# Altium schematic sheet 14.RK3568_USBPCIeSATA PHY.SchDoc
size 420 x 297 mm
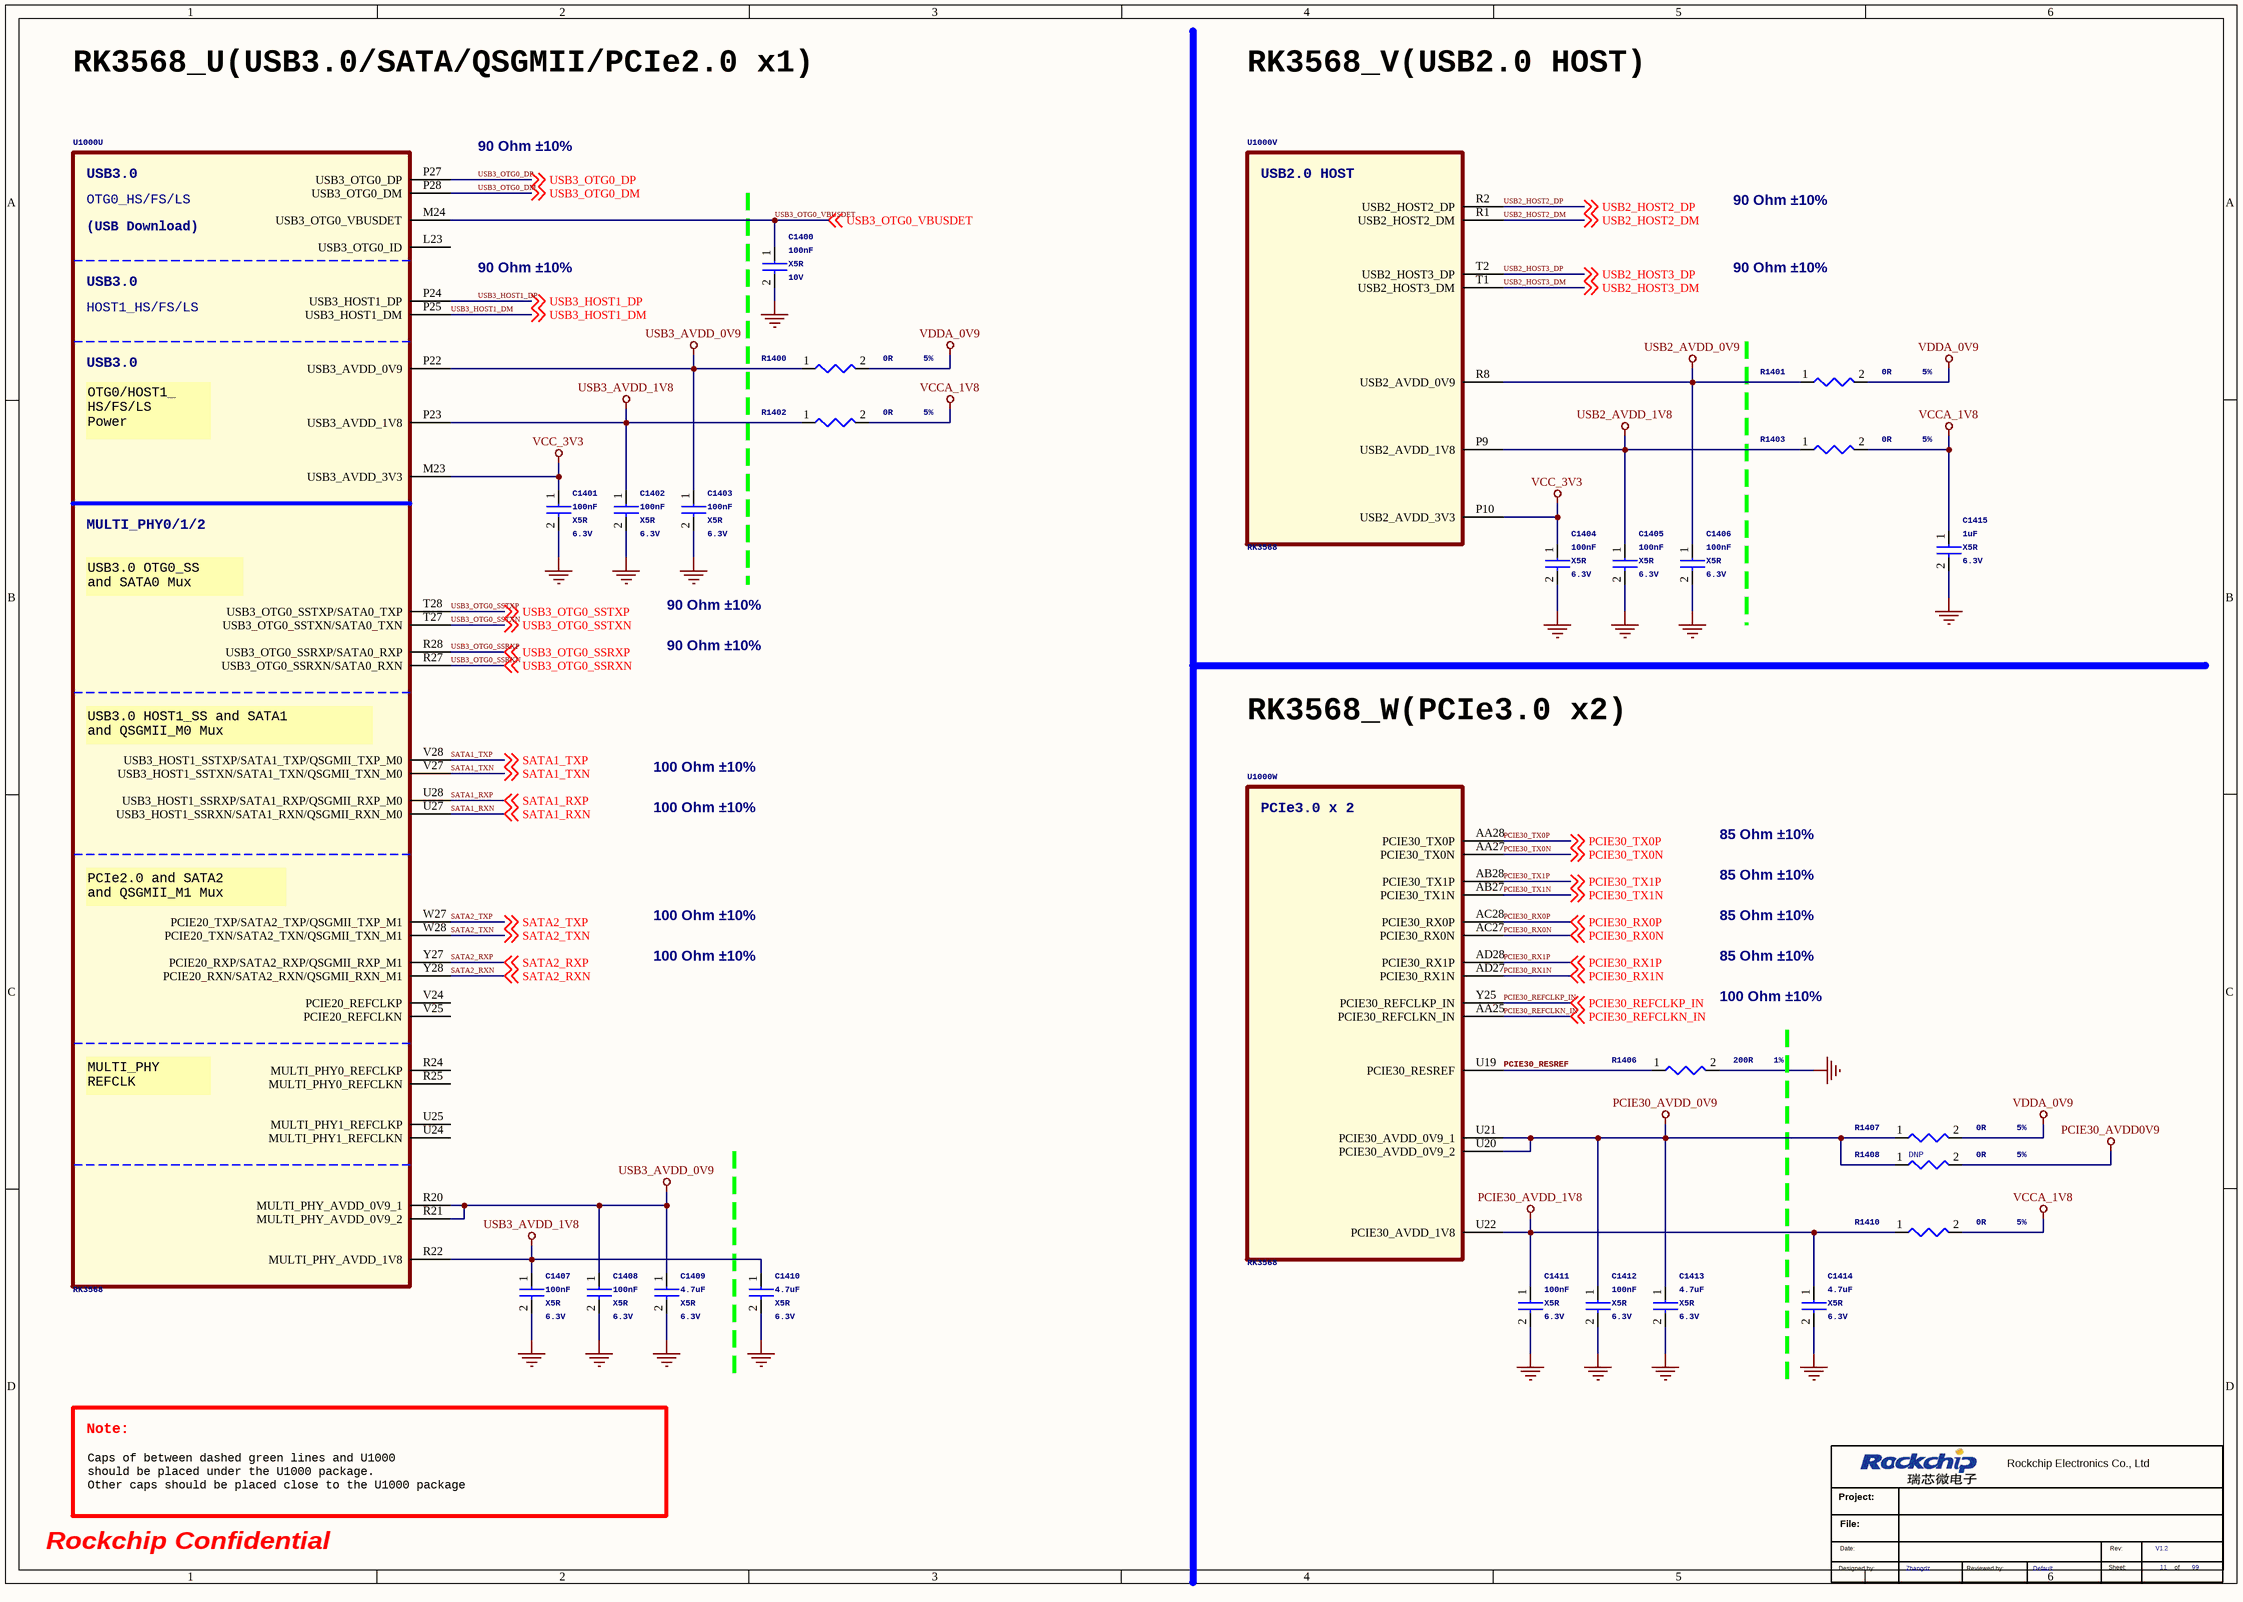
[diagram p0: 14.RK3568_USBPCIeSATA PHY.SchDoc]

## Parts
*  Schematic Page Count: 99  Schematic Page Number: 11  Designer: Zhangdz  Revision: V1.2  Check: Default  (hidden comment: Rockchip_new)  (graphical)
C1400  100nF  Voltage: 10V  Dielectric: X5R  [C0402]
C1401  100nF  Voltage: 6.3V  Dielectric: X5R  [C0201]
C1402  100nF  Voltage: 6.3V  Dielectric: X5R  [C0201]
C1403  100nF  Voltage: 6.3V  Dielectric: X5R  [C0201]
C1404  100nF  Voltage: 6.3V  Dielectric: X5R  [C0201]
C1405  100nF  Voltage: 6.3V  Dielectric: X5R  [C0201]
C1406  100nF  Voltage: 6.3V  Dielectric: X5R  [C0201]
C1407  100nF  Voltage: 6.3V  Dielectric: X5R  [C0201]
C1408  100nF  Voltage: 6.3V  Dielectric: X5R  [C0201]
C1409  4.7uF  Voltage: 6.3V  Dielectric: X5R  [C0402]
C1410  4.7uF  Voltage: 6.3V  Dielectric: X5R  [C0402]
C1411  100nF  Voltage: 6.3V  Dielectric: X5R  [C0201]
C1412  100nF  Voltage: 6.3V  Dielectric: X5R  [C0201]
C1413  4.7uF  Voltage: 6.3V  Dielectric: X5R  [C0402]
C1414  4.7uF  Voltage: 6.3V  Dielectric: X5R  [C0402]
C1415  1uF  Voltage: 6.3V  Dielectric: X5R  [C0402]
R1400  0R  Tolerance: 5%  [R0402]
R1401  0R  Tolerance: 5%  [R0402]
R1402  0R  Tolerance: 5%  [R0402]
R1403  0R  Tolerance: 5%  [R0402]
R1406  200R  Tolerance: 1%  [R0201]
R1407  0R  Tolerance: 5%  [R0402]
R1408  0R  Tolerance: 5%  Option: DNP  [R0402]
R1410  0R  Tolerance: 5%  [R0402]
U1000  RK3568  [BGA636_19R00X19R00X1R20]  (parts U,V,W of 23)

## Nets
GND: C1400.2 C1401.2 C1402.2 C1403.2 C1404.2 C1405.2 C1406.2 C1407.2 C1408.2 C1409.2 C1410.2 C1411.2 C1412.2 C1413.2 C1414.2 C1415.2 R1406.2
PCIE30_AVDD0V9: R1408.2
PCIE30_AVDD_0V9: C1412.1 C1413.1 R1407.1 R1408.1 U1000.U20(PCIE30_AVDD_0V9_2) U1000.U21(PCIE30_AVDD_0V9_1)
PCIE30_AVDD_1V8: C1411.1 C1414.1 R1410.1 U1000.U22(PCIE30_AVDD_1V8)
USB2_AVDD_0V9: C1406.1 R1401.1 U1000.R8(USB2_AVDD_0V9)
USB2_AVDD_1V8: C1405.1 R1403.1 U1000.P9(USB2_AVDD_1V8)
USB3_AVDD_0V9: C1403.1 C1408.1 C1409.1 R1400.1 U1000.P22(USB3_AVDD_0V9) U1000.R20(MULTI_PHY_AVDD_0V9_1) U1000.R21(MULTI_PHY_AVDD_0V9_2)
USB3_AVDD_1V8: C1402.1 C1407.1 C1410.1 R1402.1 U1000.P23(USB3_AVDD_1V8) U1000.R22(MULTI_PHY_AVDD_1V8)
VCC_3V3: C1401.1 C1404.1 U1000.M23(USB3_AVDD_3V3) U1000.P10(USB2_AVDD_3V3)
VCCA_1V8: C1415.1 R1402.2 R1403.2 R1410.2
VDDA_0V9: R1400.2 R1401.2 R1407.2
PCIE30_REFCLKN_IN: U1000.AA25(PCIE30_REFCLKN_IN) ; off-sheet PCIE30_REFCLKN_IN
PCIE30_REFCLKP_IN: U1000.Y25(PCIE30_REFCLKP_IN) ; off-sheet PCIE30_REFCLKP_IN
PCIE30_RESREF: R1406.1 U1000.U19(PCIE30_RESREF)
PCIE30_RX0N: U1000.AC27(PCIE30_RX0N) ; off-sheet PCIE30_RX0N
PCIE30_RX0P: U1000.AC28(PCIE30_RX0P) ; off-sheet PCIE30_RX0P
PCIE30_RX1N: U1000.AD27(PCIE30_RX1N) ; off-sheet PCIE30_RX1N
PCIE30_RX1P: U1000.AD28(PCIE30_RX1P) ; off-sheet PCIE30_RX1P
PCIE30_TX0N: U1000.AA27(PCIE30_TX0N) ; off-sheet PCIE30_TX0N
PCIE30_TX0P: U1000.AA28(PCIE30_TX0P) ; off-sheet PCIE30_TX0P
PCIE30_TX1N: U1000.AB27(PCIE30_TX1N) ; off-sheet PCIE30_TX1N
PCIE30_TX1P: U1000.AB28(PCIE30_TX1P) ; off-sheet PCIE30_TX1P
SATA1_RXN: U1000.U27(USB3_HOST1_SSRXN/SATA1_RXN/QSGMII_RXN_M0) ; off-sheet SATA1_RXN
SATA1_RXP: U1000.U28(USB3_HOST1_SSRXP/SATA1_RXP/QSGMII_RXP_M0) ; off-sheet SATA1_RXP
SATA1_TXN: U1000.V27(USB3_HOST1_SSTXN/SATA1_TXN/QSGMII_TXN_M0) ; off-sheet SATA1_TXN
SATA1_TXP: U1000.V28(USB3_HOST1_SSTXP/SATA1_TXP/QSGMII_TXP_M0) ; off-sheet SATA1_TXP
SATA2_RXN: U1000.Y28(PCIE20_RXN/SATA2_RXN/QSGMII_RXN_M1) ; off-sheet SATA2_RXN
SATA2_RXP: U1000.Y27(PCIE20_RXP/SATA2_RXP/QSGMII_RXP_M1) ; off-sheet SATA2_RXP
SATA2_TXN: U1000.W28(PCIE20_TXN/SATA2_TXN/QSGMII_TXN_M1) ; off-sheet SATA2_TXN
SATA2_TXP: U1000.W27(PCIE20_TXP/SATA2_TXP/QSGMII_TXP_M1) ; off-sheet SATA2_TXP
USB2_HOST2_DM: U1000.R1(USB2_HOST2_DM) ; off-sheet USB2_HOST2_DM
USB2_HOST2_DP: U1000.R2(USB2_HOST2_DP) ; off-sheet USB2_HOST2_DP
USB2_HOST3_DM: U1000.T1(USB2_HOST3_DM) ; off-sheet USB2_HOST3_DM
USB2_HOST3_DP: U1000.T2(USB2_HOST3_DP) ; off-sheet USB2_HOST3_DP
USB3_HOST1_DM: U1000.P25(USB3_HOST1_DM) ; off-sheet USB3_HOST1_DM
USB3_HOST1_DP: U1000.P24(USB3_HOST1_DP) ; off-sheet USB3_HOST1_DP
USB3_OTG0_DM: U1000.P28(USB3_OTG0_DM) ; off-sheet USB3_OTG0_DM
USB3_OTG0_DP: U1000.P27(USB3_OTG0_DP) ; off-sheet USB3_OTG0_DP
USB3_OTG0_SSRXN: U1000.R27(USB3_OTG0_SSRXN/SATA0_RXN) ; off-sheet USB3_OTG0_SSRXN
USB3_OTG0_SSRXP: U1000.R28(USB3_OTG0_SSRXP/SATA0_RXP) ; off-sheet USB3_OTG0_SSRXP
USB3_OTG0_SSTXN: U1000.T27(USB3_OTG0_SSTXN/SATA0_TXN) ; off-sheet USB3_OTG0_SSTXN
USB3_OTG0_SSTXP: U1000.T28(USB3_OTG0_SSTXP/SATA0_TXP) ; off-sheet USB3_OTG0_SSTXP
USB3_OTG0_VBUSDET: C1400.1 U1000.M24(USB3_OTG0_VBUSDET) ; off-sheet USB3_OTG0_VBUSDET

Not connected (* = marked no-connect by the designer): U1000 L23(USB3_OTG0_ID) R24(MULTI_PHY0_REFCLKP) R25(MULTI_PHY0_REFCLKN) U24(MULTI_PHY1_REFCLKN) U25(MULTI_PHY1_REFCLKP) V24(PCIE20_REFCLKP) V25(PCIE20_REFCLKN)

## Notes on the sheet
- RK3568_U(USB3.0/SATA/QSGMII/PCIe2.0 x1)
- RK3568_V(USB2.0 HOST)
- 90 Ohm ±10%
- RK3568_W(PCIe3.0 x2)
- 100 Ohm ±10%
- 85 Ohm ±10%
- Note:
- Caps of between dashed green lines and U1000
  should be placed under the U1000 package.
  Other caps should be placed close to the U1000 package
- Rockchip Confidential
- (in symbol Rockchip_new) Rockchip Electronics Co., Ltd; Project:; File:; Date:; Rev:; Sheet:; of; Designed by:; Reviewed by:
- (in symbol SOC_RK3568, part U) USB3.0; OTG0_HS/FS/LS; (USB Download); HOST1_HS/FS/LS; OTG0/HOST1_ / HS/FS/LS / Power; MULTI_PHY0/1/2; USB3.0 OTG0_SS / and SATA0 Mux; USB3.0 HOST1_SS and SATA1 / and QSGMII_M0 Mux; PCIe2.0 and SATA2 / and QSGMII_M1 Mux; MULTI_PHY / REFCLK
- (in symbol SOC_RK3568, part V) USB2.0 HOST
- (in symbol SOC_RK3568, part W) PCIe3.0 x 2

## Library data of the parts
* = Rockchip_new: Page Count: 37; Revcode: V1.2; Page Number: 11
C1400 = CAP NP: cap,100.00nF,+/-10%,10V,X5R,C0402; Manufacturer PN: C1005X5R1A104K050BA; Manufacturer: TDK; Tolerance: 10%; Priority: A; Created by: JJJ; Part Type: C0402; RK PN: C1005X5R1A104K050BA
C1401-C1408 C1412 = CAP NP: cap,100.00nF,+/-10%,6.3V,X5R,C0201; Manufacturer PN: C0603X5R0J104K030BC; Manufacturer: TDK; Tolerance: 10%; Priority: A; Created by: JJJ; Part Type: C0201; RK PN: C0603X5R0J104K030BC
C1409 C1410 C1413 C1414 = CAP NP: cap,4.70uF,+/-10%,6.3V,X5R,C0402; Manufacturer PN: C1005X5R0J475K050BC; Manufacturer: TDK; Tolerance: 10%; Priority: A; Created by: JJJ; Part Type: C0402; RK PN: C1005X5R0J475K050BC
C1411 = CAP NP: cap,100.00nF,+/-10%,6.3V,X5R,C0201; Manufacturer: TDK; RK PN: C0603X5R0J104K030BC; Priority: A; Tolerance: 10%; Part Type: C0201; Manufacturer PN: C0603X5R0J104K030BC; Created by: JJJ
C1415 = CAP NP: cap,1.00uF,+/-10%,6.3V,X5R,C0402; Manufacturer: TDK; RK PN: C1005X5R0J105K050BB; Priority: A; Tolerance: 10%; Part Type: C0402; Manufacturer PN: C1005X5R0J105K050BB; Created by: JJJ
R1400 R1402 R1403 R1407 = RESISTOR: 通用厚膜电阻,0R,+/-5%,R0402,1/16W.; Manufacturer: YAGEO; RK PN: RC0402JR-070RL; Priority: A; Wattage: 1/16W; Part Type: 通用厚膜电阻; Manufacturer PN: RC0402JR-070RL; Created by: YTL
R1401 R1408 R1410 = RESISTOR: 通用厚膜电阻,0R,+/-5%,R0402,1/16W.; Manufacturer PN: RC0402JR-070RL; Manufacturer: YAGEO; Wattage: 1/16W; Priority: A; Created by: YTL; Part Type: 通用厚膜电阻; RK PN: RC0402JR-070RL
R1406 = RESISTOR: 通用厚膜电阻,200R,+/-1%,R0201,1/20W.; Manufacturer PN: RC0201FR-07200RL; Manufacturer: YAGEO; Wattage: 1/20W; Priority: A; Created by: YTL; Part Type: 通用厚膜电阻; RK PN: RC0201FR-07200RL
U1000 = SOC_RK3568: ROCKCHIP SOC; Manufacturer: Rockchip (瑞芯微); SPLIT_INST: TRUE; SWAP_INFO: (S1+S2+S3+S4+S5+S6+S7+S8+S9+S10+S11+S12+S13+S14+S15+S16+S17+S18+S19+S20+S21+S22+S23); Priority: A; RK PN: RK3568; Part Type: SOC; Manufacturer PN: RK3568; Created by: JJJ